# Altium schematic sheet FuncGen_ST.SchDoc
size A; SheetNumber: 2; SheetTotal: 3
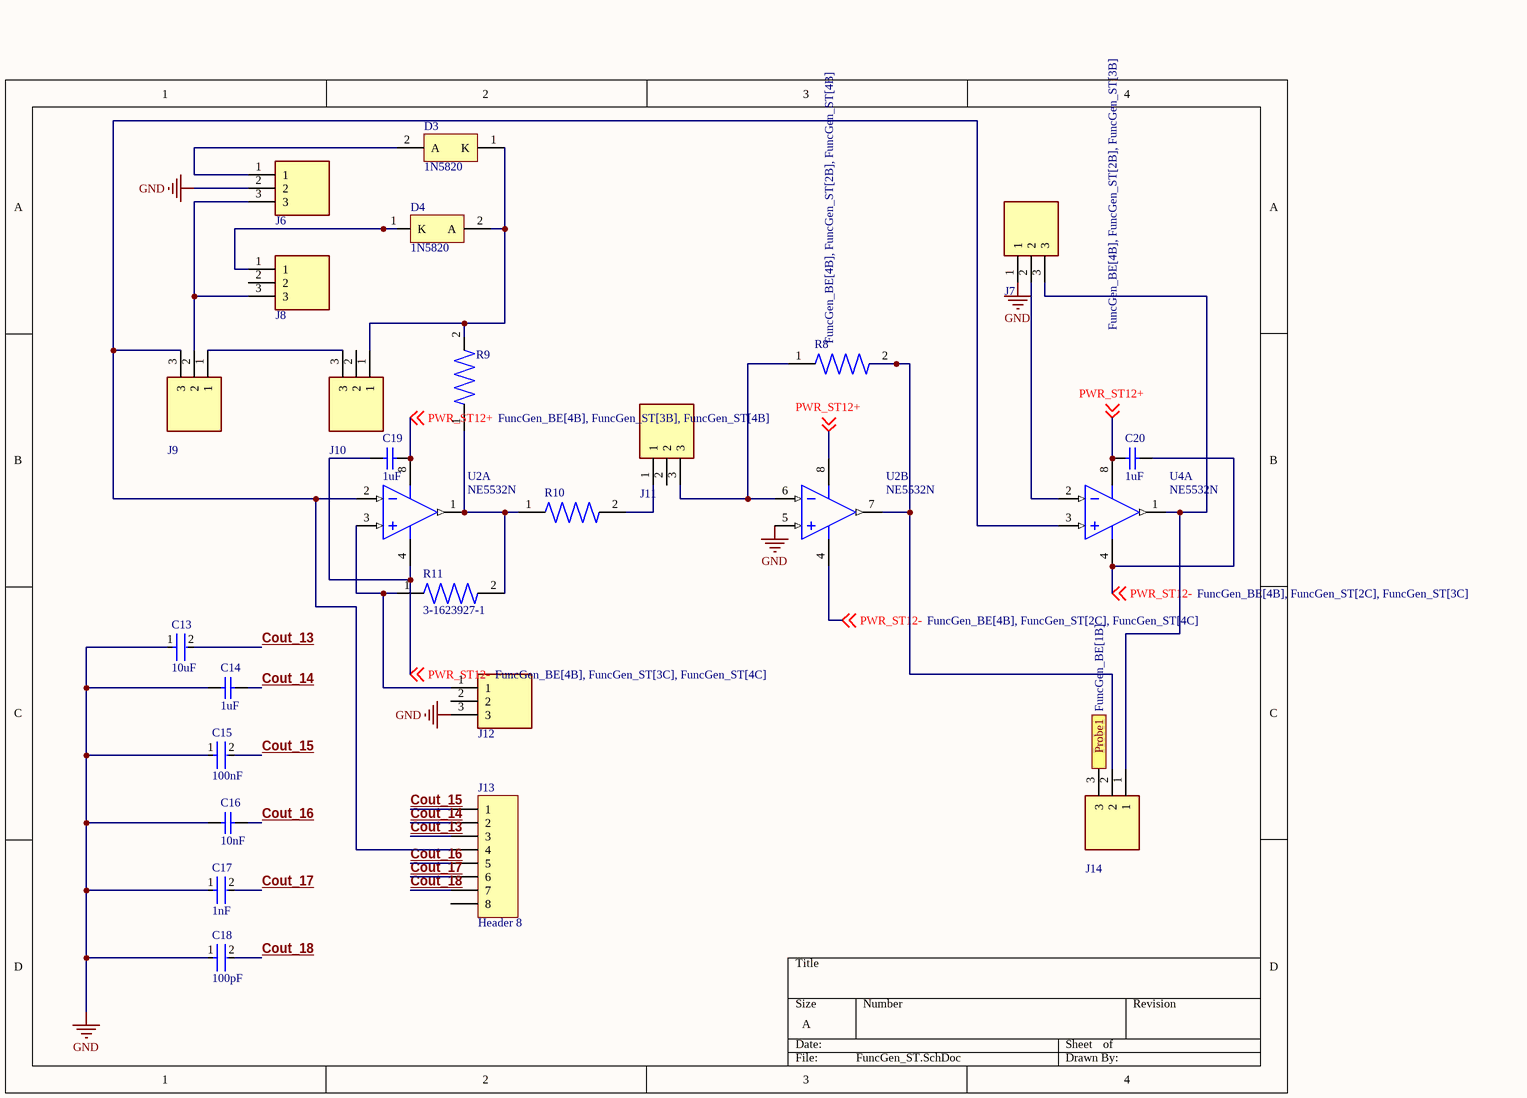
[diagram p0: FuncGen_ST.SchDoc]

## Parts
C13  10uF  [FP-RCE3M1-MFG]
C14  1uF  [KEMT-C330C105M5U5TA]
C15  100nF  [FP-C322C104K5R5TA-MFG]
C16  10nF  [KEMT-C315-THT-2]
C17  1nF  [FP-DE6_D7_T7_F7_5_d0_6-0-MFG]
C18  100pF  [FP-RCE0K1-MFG]
C19  1uF  [KEMT-C330C105M5U5TA]
C20  1uF  [KEMT-C330C105M5U5TA]
D3  1N5820  [ONSC-AXIAL_LEAD-2-267-05_V]
D4  1N5820  [ONSC-AXIAL_LEAD-2-267-05_V]
J6  3-644456-3  [TE_3-644456-3]  (value not drawn)
J7  3-644456-3  [TE_3-644456-3]  (value not drawn)
J8  3-644456-3  [TE_3-644456-3]  (value not drawn)
J9  3-644456-3  [TE_3-644456-3]  (value not drawn)
J10  3-644456-3  [TE_3-644456-3]  (value not drawn)
J11  3-644456-3  [TE_3-644456-3]  (value not drawn)
J12  3-644456-3  [TE_3-644456-3]  (value not drawn)
J13  Header 8  [HDR1X8]
J14  3-644456-3  [TE_3-644456-3]  (value not drawn)
R8  3-1623927-1  [RESAD700W45L350D185]  (value not drawn)
R9  3-1623927-1  [RESAD700W45L350D185]  (value not drawn)
R10  3-1623927-1  [RESAD700W45L350D185]  (value not drawn)
R11  3-1623927-1  [RESAD700W45L350D185]
U2  NE5532N  [ONSC-PDIP-8-626-05]  (parts A,B of 2)
U4  NE5532N  [ONSC-PDIP-8-626-05]  (part A of 2)

## Ports
Probe1 (see FuncGen_BE[1B])

## Nets
GND: C13.1 C14.1 C15.1 C16.1 C17.1 C18.1 J6.2 J7.1 J12.3 U2.5(INB+)
Cout_13: C13.2 J13.3
Cout_14: C14.2 J13.2
Cout_15: C15.2 J13.1
Cout_16: C16.2 J13.5
Cout_17: C17.2 J13.6
Cout_18: C18.2 J13.7
Probe1: J14.3 ; port Probe1
PWR_ST12+: C19.2 C20.1 U2.8(V+) U4.8(V+) ; off-sheet PWR_ST12+
PWR_ST12-: C19.1 C20.2 U2.4(V-) U4.4(V-) ; off-sheet PWR_ST12-
NetD3_1: D3.1(K) D4.2(A) J10.1 R9.2
NetD3_2: D3.2(A) J6.1
NetD4_1: D4.1(K) J8.1
NetJ6_3: J6.3 J8.3 J9.2
NetJ7_2: J7.2 U4.2(INA-)
NetJ7_3: J7.3 J14.1 U4.1(OUTA)
NetJ9_1: J9.1 J10.3
NetJ9_3: J9.3 J13.4 U2.2(INA-) U4.3(INA+)
NetJ11_1: J11.1 R10.2
NetJ11_3: J11.3 R8.1 U2.6(INB-)
NetJ12_1: J12.1 R11.1 U2.3(INA+)
NetJ14_2: J14.2 R8.2 U2.7(OUTB)
NetR9_1: R9.1 R10.1 R11.2 U2.1(OUTA)

Not connected (* = marked no-connect by the designer): J8 2; J10 2; J11 2; J12 2; J13 8

## Library data of the parts
C13 = CMP-06035-005744-1: Cap Ceramic 10uF 25V X7R ±10% Radial 5mm +125°C Automotive Ammo Pack; Lead/Base Style: Formed Leads; Lead Diameter: 0.5mm; Length: 0.217inch; Package Quantity: 1500; Width: 0.157inch; Resistor Type: Ceramic; Height - Seated (Max): 0.197inch; Ratings: AEC-Q200; Lead Pitch: 0.197inch; Packaging: Tape and Reel; Tolerance: 10%; Voltage Rating (DC): 25V; Capacitance: 10uF; Termination: Radial; Mount: Through Hole; Voltage Rating: 25V; Min Operating Temperature: -55°C; Height: 5mm; Dielectric: X7R; Max Operating Temperature: 125°C; Case/Package: Radial
C14 C19 C20 = CMP-2000-06056-1: Ceramic Capacitor, 1 uF, +/- 20%, 50 V, -10 to 85 degC, 2-Pin THD, RoHS, Bulk; Manufacturer: Kemet; Voltage - Rated: 50V; Temperature Coefficient: Z5U; Catalog Drawings: C330(std); Product Training Modules: CapacitorBasics-TypicalUsesforCapacitors; Capacitance: 1µF; Online Catalog: GoldenMax™Series; Other Names: 399-4390; PCN Design/Specification: C3yySeriesGoldenMaxLeadConfiguration02/Feb/2015; Thickness (Max): -; Size / Dimension: 0.300"Lx0.150"W(7.62mmx3.81mm); Mounting Technology: ThroughHole; Tolerance: ±20%; Mounting Type: ThroughHole; Datasheet URL: http://www.kemet.com/Lists/ProductCatalog/Attachments/599/KEM_C1051_GOLDMAX_Z5U.pdf; Series: GoldenMax™; Standard Package: 250; Ratings: -; Applications: GeneralPurpose; Package Reference: C330C105M5U5TA; Packaging: Bulk; Category: Capacitors; Package Description: 2-Pin Through Hole Device, Body 7.11 x 4.07 mm; Operating Temperature: 10°C~85°C; Height - Seated (Max): 0.360"(9.14mm); Manufacturer URL: http://www.kemet.com/; Lead Spacing: 0.200"(5.08mm); Features: -; Lead Style: Straight; Package / Case: Radial; Family: CeramicCapacitors; Datasheet Version: 12/2015
C15 = CMP-03020-034661-1: CAP CER 0.1UF 50V X7R RADIAL; Dielectric Material: Ceramic; Dissipation Factor: 2.5%; Lead Length: 7mm; Tolerance: 10%; Lead Diameter: 0.51mm; Lead/Base Style: Formed Leads; Capacitance: 100nF; Construction: RADIAL; RoHS Compliant: Yes; Voltage Rating (DC): 50V; Packaging: Bulk; Lead Free: Lead Free; Width: 0.125inch; Lead Pitch: 5.08mm; Voltage Rating: 50V; Number of Pins: 2; Radiation Hardening: No; Material: Ceramic; REACH SVHC: No SVHC; Height - Seated (Max): 0.26inch; Case/Package: Radial; Weight: 0.0625lb; Dielectric: X7R; Min Operating Temperature: -55°C; Voltage: 50V; Series: Golden Max™; Max Operating Temperature: 125°C; Height: 3.18mm; Termination: Radial; Length: 5.08mm; Depth: 3.18mm; Package Quantity: 500; Mount: Through Hole
C16 = CMP-1664-00007-1: Capacitor, Ceramic, 0.01 uF, +/- 10%, 100 V, X7R, -55 to 125 degC, 2-Pin THD, RoHS, Bulk; Output Voltage: 70 V; Case\Package: PDIP; Forward Current: 60 mA; Nominal Vf: 1.3 V; Forward Voltage: 1.5 V; Channels: 2; Max Power Dissipation: 400 mW; Vce Max: 500 mV; ComponentLink1Description: Manufacturer URL; ComponentLink2Description: Datasheet; Packaging: Rail/Tube; RoHSCompliant: true; Package Quantity: 2000; PackageReference: C315-THT-2; Min Operating Temperature: -55 degC; Max Operating Temperature: 100 degC; Radiation Hardening: No; ComponentLink1URL: http://www.kemet.com/; DatasheetVersion: Aug-16; Pins: 16; PackageDescription: 2-Pin Through Hole Device, Body 3.81 x 2.54 mm; REACH SVHC: Unknown; Mount: Through Hole; ComponentLink2URL: http://capacitoredge.kemet.com/capedge2/DataSheet/Datasheet-C315C103K1R5TA.pdf?pn=C315C103K1R5TA{BULK}
C17 = CMP-06035-062244-1: CAP CER 1000PF 300VAC RADIAL; Lead/Base Style: Formed Leads; Material: Ceramic; Tolerance: 20%; Lead Diameter: 0.6mm; Voltage Rating (AC): 300V; Termination: Radial; RoHS Compliant: Yes; Width: 7mm; Package Quantity: 700; Lead Pitch: 7.5mm; Capacitance: 1nF; Case/Package: Radial; Resistor Type: Ceramic; Ratings: AEC-Q200; Series: KJ; Depth: 7mm; Min Operating Temperature: -25°C; Height - Seated (Max): 0.394inch; Mount: Through Hole; REACH SVHC: No SVHC; Max Operating Temperature: 125°C; Packaging: Bulk
C18 = CMP-06035-040252-1: Cap Ceramic 100pF 50V C0G ±5% Radial 5mm +125°C Automotive Bulk; Lead Diameter: 0.5mm; Lead/Base Style: Formed Leads; Mount: Through Hole; Height: 3.5mm; Voltage Rating: 50V; Lead Pitch: 0.197inch; Packaging: Bulk; Capacitance: 100pF; Height - Seated (Max): 0.138inch; Length: 0.142inch; Max Operating Temperature: 125°C; Resistor Type: Ceramic; Case/Package: Radial; Package Quantity: 500; Voltage Rating (DC): 50V; Tolerance: 5%; Width: 2.5mm; Termination: Radial; Ratings: AEC-Q200; Dielectric: C0G; Min Operating Temperature: -55°C
D3 D4 = CMP-1055-00030-1: Rectifier, 2-Pin Axial_Lead, Bulk Bag; Manufacturer: On Semiconductor; Note1: 0; IFSM Max (A): 80; Configuration: Single; PackageReference: AXIAL_LEAD-2-267-05; ComponentLink3URL: http://www.onsemi.com/pub_link/Collateral/267-05.PDF; ComponentLink1Description: Manufacturer URL; PartNumber: 1N5820; ComponentLink2URL: http://www.onsemi.cn/pub_link/Collateral/1N5820-D.PDF; DatasheetVersion: Rev. 10; PackageVersion: Rev. G, 06/2000; ComponentLink2Description: Datasheet; Packing: Bulk Bag; PackageDescription: 2-Pin, Axial Lead, Diameter 5.05 mm; Mounting Technology: Through Hole; ComponentLink1URL: http://www.onsemi.com/; ComponentLink3Description: Package Specification; RoHS: FALSE
J6-J12 J14 = 3-644456-3: MTA-100 3 Position Through-Hole Single Row Straight Wire to Board Header; Centerline_Pitch: 2.54 mm[.1 in]; Product_Type: Connector; MF: TE Connectivity; Number_of_Positions: 3; MP: 3-644456-3; Price: None; Package: None; Availability: Unavailable; SnapEDA_Link: https://www.snapeda.com/parts/3-644456-3/TE%20Connectivity%20AMP%20Connectors/view-part/2772999/?ref=snap; Value: *; TE_purchase_URL: https://www.te.com/usa-en/product-3-644456-3.html?te_bu=Cor&te_type=disp&te_campaign=seda_glo_cor-seda-global-disp-prtnr-fy19-seda-model-bom-cta_sma-317_1&elqCampaignId=32493
J13 = Header 8: Header, 8-Pin; LatestRevisionDate: 17-Jul-2002; LatestRevisionNote: Re-released for DXP Platform.; Publisher: Altium Limited
R8-R11 = 3-1623927-1: 1 MOhms Â±5% 0.25W, 1/4W Through Hole Resistor Axial - Carbon Film; MF: TE Connectivity; Price: None; SnapEDA_Link: https://www.snapeda.com/parts/3-1623927-1/TE+Connectivity/view-part/?ref=snap; Check_prices: https://www.snapeda.com/parts/3-1623927-1/TE+Connectivity/view-part/?ref=eda; Value: *; MP: 3-1623927-1; Package: None; Availability: In Stock
U2 U4 = CMP-1310-00070-1: Internally Compensated Dual Low Noise Operational Amplifier, 6 to 40 V, 0 to 70 degC, 8-Pin PDIP, Tube; Manufacturer: On Semiconductor; VCC Min (V): 6; VCC Max (V): 40; GBW Typ (MHz): 10; SR Typ (V/uS): 9; Mounting Technology: Through Hole; PackageVersion: Rev. N, 06/2013; PartNumber: NE5532N; PackageDescription: 8-Pin Plastic Dual-In Line Package, Body 9.59 x 6.605 mm, Pitch 2.54 mm; ComponentLink3URL: http://www.onsemi.cn/pub_link/Collateral/626-05.PDF; PackageReference: PDIP-8-626-05; ComponentLink2Description: Datasheet; ComponentLink3Description: Package Specification; RoHS: FALSE; ComponentLink1URL: http://www.onsemi.com/; ComponentLink1Description: Manufacturer URL; ComponentLink2URL: http://www.onsemi.cn/pub_link/Collateral/NE5532-D.PDF; Packing: Tube; DatasheetVersion: Rev. 2